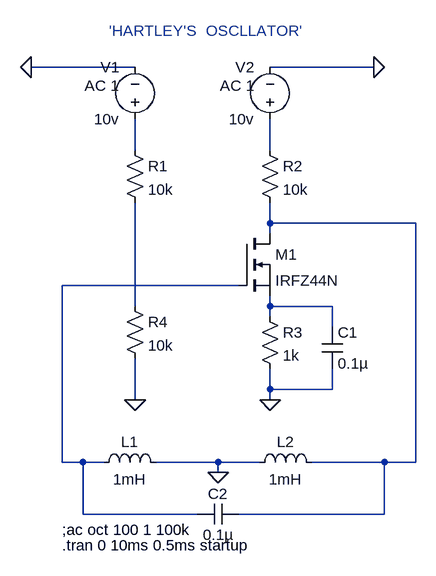
[diagram p0: schematic Hartleys Oscillator.asc]
Hartleys Oscillator.asc, the LTspice schematic file:
Version 4
SHEET 1 880 740
WIRE 128 -16 -32 -16
WIRE 496 -16 336 -16
WIRE 128 112 128 64
WIRE 336 112 336 64
WIRE 336 224 336 192
WIRE 560 224 336 224
WIRE 336 240 336 224
WIRE 288 320 16 320
WIRE 128 352 128 192
WIRE 336 352 336 336
WIRE 432 352 336 352
WIRE 336 368 336 352
WIRE 432 384 432 352
WIRE 336 480 336 448
WIRE 432 480 432 448
WIRE 432 480 336 480
WIRE 128 496 128 432
WIRE 336 496 336 480
WIRE 16 592 16 320
WIRE 48 592 16 592
WIRE 80 592 48 592
WIRE 256 592 160 592
WIRE 320 592 256 592
WIRE 512 592 400 592
WIRE 560 592 560 224
WIRE 560 592 512 592
WIRE 256 608 256 592
WIRE 48 672 48 592
WIRE 224 672 48 672
WIRE 512 672 512 592
WIRE 512 672 288 672
FLAG 336 496 0
FLAG 128 496 0
FLAG 256 608 0
FLAG -32 -16 0
FLAG 496 -16 0
SYMBOL voltage 128 80 R180
WINDOW 0 24 96 Left 2
WINDOW 3 24 16 Left 2
WINDOW 123 24 68 Left 2
WINDOW 39 0 0 Left 0
SYMATTR InstName V1
SYMATTR Value 10v
SYMATTR Value2 AC 1
SYMBOL voltage 336 80 R180
WINDOW 0 24 96 Left 2
WINDOW 3 24 16 Left 2
WINDOW 123 24 68 Left 2
WINDOW 39 0 0 Left 0
SYMATTR InstName V2
SYMATTR Value 10v
SYMATTR Value2 AC 1
SYMBOL res 320 96 R0
SYMATTR InstName R2
SYMATTR Value 10k
SYMBOL res 112 96 R0
SYMATTR InstName R1
SYMATTR Value 10k
SYMBOL nmos 288 240 R0
SYMATTR InstName M1
SYMATTR Value IRFZ44N
SYMBOL res 320 352 R0
SYMATTR InstName R3
SYMATTR Value 1k
SYMBOL res 112 336 R0
SYMATTR InstName R4
SYMATTR Value 10k
SYMBOL cap 416 384 R0
SYMATTR InstName C1
SYMATTR Value 0.1µ
SYMBOL ind 64 608 R270
WINDOW 0 32 56 VTop 2
WINDOW 3 5 56 VBottom 2
SYMATTR InstName L1
SYMATTR Value 1mH
SYMBOL ind 304 608 R270
WINDOW 0 32 56 VTop 2
WINDOW 3 5 56 VBottom 2
SYMATTR InstName L2
SYMATTR Value 1mH
SYMBOL cap 288 656 R90
WINDOW 0 0 32 VBottom 2
WINDOW 3 32 32 VTop 2
SYMATTR InstName C2
SYMATTR Value 0.1µ
TEXT 16 720 Left 2 !.tran 0 10ms 0.5ms startup
TEXT 16 696 Left 2 !;ac oct 100 1 100k
TEXT 88 -72 Left 2 ;'HARTLEY'S  OSCLLATOR'

The netlist it stands for:
* Hartleys Oscillator.asc
V1 N001 0 10v AC 1
V2 N002 0 10v AC 1
R2 N002 N003 10k
R1 N001 N005 10k
M1 N003 N004 N006 N006 IRFZ44N
R3 N006 0 1k
R4 N005 0 10k
C1 N006 0 0.1µ
L1 N004 0 1mH
L2 0 N003 1mH
C2 N003 N004 0.1µ
.model NMOS NMOS
.model PMOS PMOS
.lib standard.mos
.tran 0 10ms 0.5ms startup
;ac oct 100 1 100k
* 'HARTLEY'S  OSCLLATOR'
.backanno
.end